# Altium schematic sheet W801.SchDoc
size A4
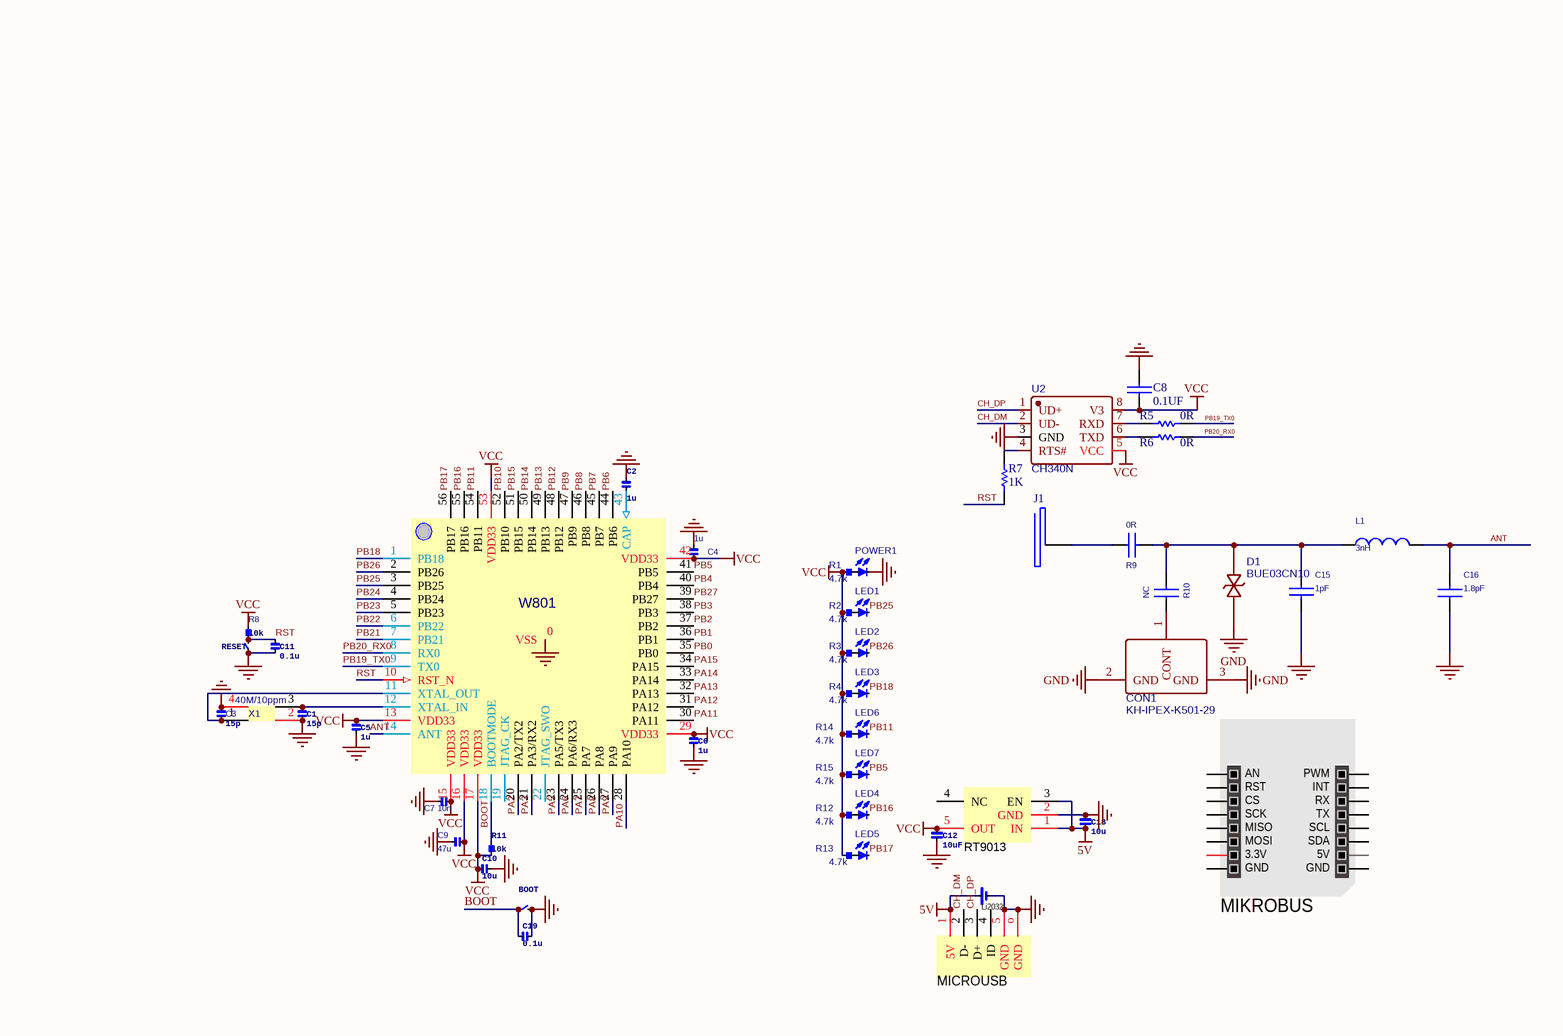
[diagram p0: W801.SchDoc]

## Parts
BOOT  (no value)
C1  15p  [0603]
C2  1u  [0603]
C3  15p  [0603]
C4  1u  [0603]
C5  1u  [0603]
C6  1u  [0603]
C7  10n  [0603]
C8  0.1UF  [C 0603_L]
C9  47u  [0805]
C10  10u  [0603]
C11  0.1u  [0603]
C12  10uF  [1206]
C15  1pF  [C 0402_L]
C16  1.8pF  [C 0402_L]
C18  10u  [1206]
C19  0.1u  [0603]
CON1  KH-IPEX-K501-29  [SMA/UFLR/NI]
D1  BUE03CN10  [X1-DFN1006-2_L1.0-W0.6-RD]
J1  (no value)  [TX1]
L1  3nH  [0402A]
LED1  (no value)  [0603]
LED2  (no value)  [0603]
LED3  (no value)  [0603]
LED4  (no value)  [0603]
LED5  (no value)  [0603]
LED6  (no value)  [0603]
LED7  (no value)  [0603]
Li2032  (no value)
MICROUSB  (no value)  [MICROUSB]
MIKROBUS  (no value)  [MIKROBUS]
POWER1  (no value)  [0603]
R1  4.7k  [0603]
R2  4.7k  [0603]
R3  4.7k  [0603]
R4  4.7k  [0603]
R5  0R  [R 0603_L]
R6  0R  [R 0603_L]
R7  1K  [R 0603_L]
R8  10k  [0603]
R9  0R  [R 0402_L]
R10  NC  [R 0402_L]
R11  10k  [0603]
R12  4.7k  [0603]
R13  4.7k  [0603]
R14  4.7k  [0603]
R15  4.7k  [0603]
RESET  (no value)
RT9013  (no value)  [SGM2028]
U2  CH340N  [SOP8_L]
W801  (no value)  [W801]
X1  40M/10ppm  [3225]

## Nets
5V: C18.1 Li2032.1 MICROUSB.1(5V) RT9013.1(IN) RT9013.3(EN)
GND: BOOT.2 C1.2 C2.2 C3.2 C4.1 C5.2 C6.2 C7.1 C8.1 C9.2 C10.2 C11.2 C12.2 C15.2 C16.1 C18.2 C19.2 CON1.2(GND) CON1.3(GND) D1.2 Li2032.2 MICROUSB.5(GND) MICROUSB.o(GND) POWER1.2 RESET.1 RT9013.2(GND) U2.3(GND) W801.0(VSS) X1.2 X1.4
VCC: C4.2 C5.1 C6.1 C7.2 C8.2 C9.1 C10.1 C12.1 R1.2 R2.2 R3.2 R4.2 R8.1 R11.1 R12.2 R13.2 R14.2 R15.2 RT9013.5(OUT) U2.5(VCC) U2.8(V3) W801.13(VDD33) W801.15(VDD33) W801.16(VDD33) W801.17(VDD33) W801.29(VDD33) W801.42(VDD33) W801.53(VDD33)
ANT: C16.2 L1.1 W801.14(ANT)
BOOT: BOOT.1 C19.1 R11.2 W801.18(BOOTMODE)
CH_DM: MICROUSB.2(D-) U2.2(UD-)
CH_DP: MICROUSB.3(D+) U2.1(UD+)
PA2: W801.20(PA2/TX2)
PA3: W801.21(PA3/RX2)
PA5: W801.23(PA5/TX3)
PA6: W801.24(PA6/RX3)
PA7: W801.25(PA7)
PA8: W801.26(PA8)
PA9: W801.27(PA9)
PA10: W801.28(PA10)
PA11: W801.30(PA11)
PA12: W801.31(PA12)
PA13: W801.32(PA13)
PA14: W801.33(PA14)
PA15: W801.34(PA15)
PB0: W801.35(PB0)
PB1: W801.36(PB1)
PB2: W801.37(PB2)
PB3: W801.38(PB3)
PB4: W801.40(PB4)
PB5: LED7.2 W801.41(PB5)
PB6: W801.44(PB6)
PB7: W801.45(PB7)
PB8: W801.46(PB8)
PB9: W801.47(PB9)
PB10: W801.52(PB10)
PB11: LED6.2 W801.54(PB11)
PB12: W801.48(PB12)
PB13: W801.49(PB13)
PB14: W801.50(PB14)
PB15: W801.51(PB15)
PB16: LED4.2 W801.55(PB16)
PB17: LED5.2 W801.56(PB17)
PB18: LED3.2 W801.1(PB18)
PB19_TX0: R5.2 W801.9(TX0)
PB20_RX0: R6.2 W801.8(RX0)
PB21: W801.7(PB21)
PB22: W801.6(PB22)
PB23: W801.5(PB23)
PB24: W801.4(PB24)
PB25: LED1.2 W801.3(PB25)
PB26: LED2.2 W801.2(PB26)
PB27: W801.39(PB27)
RST: C11.1 R7.1 R8.2 RESET.2 W801.10(RST_N)
NetC1_1: C1.1 W801.12(XTAL_IN) X1.3
NetC2_1: C2.1 W801.43(CAP)
NetC3_1: C3.1 W801.11(XTAL_OUT) X1.1
NetC15_1: C15.1 D1.1 L1.2 R9.2 R10.2
NetCON1_1: CON1.1(CONT) R10.1
NetJ1_1: J1.1 R9.1
NetLED1_1: LED1.1 R2.1
NetLED2_1: LED2.1 R3.1
NetLED3_1: LED3.1 R4.1
NetLED4_1: LED4.1 R12.1
NetLED5_1: LED5.1 R13.1
NetLED6_1: LED6.1 R14.1
NetLED7_1: LED7.1 R15.1
NetPOWER1_1: POWER1.1 R1.1
NetR5_1: R5.1 U2.7(RXD)
NetR6_1: R6.1 U2.6(TXD)
NetR7_2: R7.2 U2.4(RTS#)

Not connected (* = marked no-connect by the designer): MICROUSB 4(ID); MIKROBUS 1(AN) 2(RST) 3(CS) 4(SCK) 5(MISO) 6(MOSI) 7(3.3V) 8(GND) 9(GND) 10(5V) 11(SDA) 12(SCL) 13(TX) 14(RX) 15(INT) 16(PWM); RT9013 4(NC); W801 19(JTAG_CK) 22(JTAG_SWO)

## Library data of the parts
BOOT RESET = key
C1-C7 C9-C12 C18 C19 = C
C8 = CAP: Capacitor
C15 R9 R10 = CAP NP_Dup2
C16 = CAP NP
CON1 = KH-IPEX-K501-29: BOM_Manufacturer: Shenzhen Kinghelm Elec; Contributor: LCSC; BOM_Supplier: LCSC; BOM_Supplier Part: C411563; BOM_Manufacturer Part: KH-IPEX-K501-29; spicePre: R; spiceSymbolName: KH-IPEX-K501-29
D1 = PT05D5CE: BOM_Manufacturer: PTTC(Polytronics Tech); Contributor: LCSC; BOM_Supplier: LCSC; BOM_Supplier Part: C492000; BOM_Manufacturer Part: PT05D5CE; spicePre: D; spiceSymbolName: PT05D5CE
J1 = Component_1
L1 = INDUCTOR
LED1-LED7 POWER1 = LED0
Li2032 = Li2032
MICROUSB = MICROUSB
MIKROBUS = MIKROBUS
R1-R4 R8 R11-R15 = R
R5-R7 = Res1: Resistor; Published: 8-Jun-2000; LatestRevisionDate: 17-Jul-2002; LatestRevisionNote: Re-released for DXP Platform.; PackageReference: AXIAL-0.3; Publisher: Altium Limited
  R5 R6: Value: 0R
  R7: Value: 1K
RT9013 = SGM2028
U2 = CH340N: BOM_Manufacturer: WCH(Jiangsu Qin Heng); Contributor: LCSC; BOM_Supplier: LCSC; BOM_Supplier Part: C506813; BOM_Manufacturer Part: CH340N; BOM_JLCPCB Part Class: Extended Part; spicePre: U; spiceSymbolName: CH340N
W801 = W801
X1 = CRYSTAL